# EAGLE design rapidshark-flywheel-controller-mk-1.5 (EAGLE 7.5.0)
AUTHOR: sean@yak.net
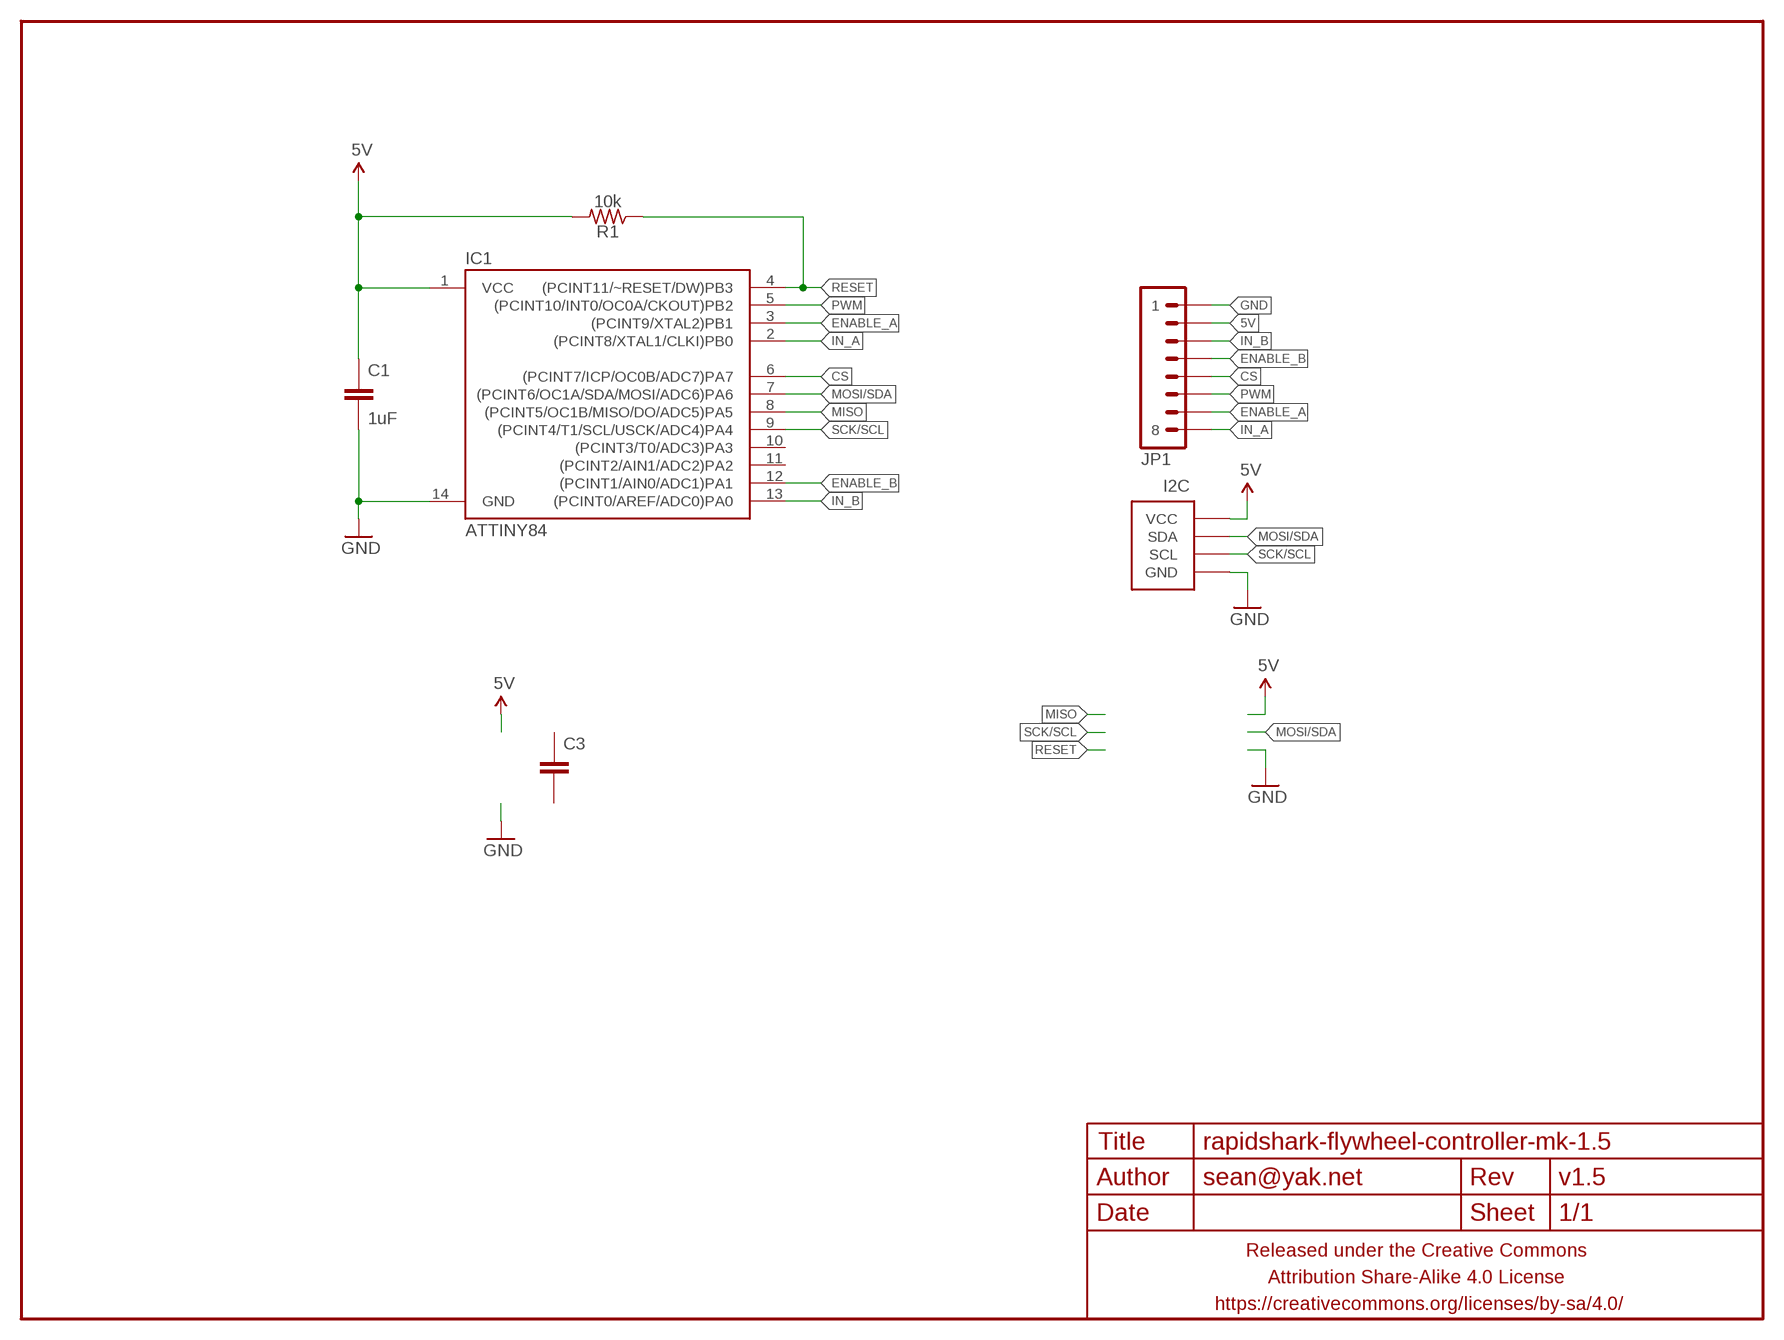
[diagram p0: schematic, sheet 1]

## Parts
C1  1uF  CAPACITOR-CERAMICC0603-TIGHTER  [C0603-TIGHTER]
C3  CAPACITOR-CERAMICC0603-TIGHTER  [C0603-TIGHTER]
FRAME1  FRAME-LETTERNO_PACKAGE  [DUMMY]
I2C  M04-I2CJST-4-PH-RA-CENTERED  [1X04-JST-PH-RA-PTH-I2C-CENTERED]
IC1  ATTINY84  [SO14]
JP1  M081X08  [1X08]
R1  10k  RESISTORPTH-AXIAL-5.08MM  [RESISTOR-AXIAL-PTH-5.08MM]

## Nets
5V: C1.1 I2C.2(VCC) IC1.1(VCC) JP1.2 R1.P$2
CS: IC1.6((PCINT7/ICP/OC0B/ADC7)PA7) JP1.5
ENABLE_A: IC1.3((PCINT9/XTAL2)PB1) JP1.7
ENABLE_B: IC1.12((PCINT1/AIN0/ADC1)PA1) JP1.4
GND: C1.2 I2C.1(GND) IC1.14(GND) JP1.1
IN_A: IC1.2((PCINT8/XTAL1/CLKI)PB0) JP1.8
IN_B: IC1.13((PCINT0/AREF/ADC0)PA0) JP1.3
MISO: IC1.8((PCINT5/OC1B/MISO/DO/ADC5)PA5)
MOSI/SDA: I2C.3(SDA) IC1.7((PCINT6/OC1A/SDA/MOSI/ADC6)PA6)
PWM: IC1.5((PCINT10/INT0/OC0A/CKOUT)PB2) JP1.6
RESET: IC1.4((PCINT11/~RESET/DW)PB3) R1.P$1
SCK/SCL: I2C.4(SCL) IC1.9((PCINT4/T1/SCL/USCK/ADC4)PA4)
Unconnected: C3.1 C3.2 IC1.10((PCINT3/T0/ADC3)PA3) IC1.11((PCINT2/AIN1/ADC2)PA2)

## Library data of the parts
C1 C3 = a_parts:CAPACITOR-CERAMIC: CAPACITOR, European symbol
FRAME1 = A_butts:FRAME-LETTER: Schematic Frame Standard 8.5x11 US Letter frame; DESIGNER: sean@yak.net; VERSION: v1.5
I2C = A_butts:M04-I2C
IC1 = A_butts:ATTINY84: Atmel 14-pin 2/4/8kB flash uC
JP1 = A_butts:M08: Header 8 Standard 8-pin 0.1" header. Use with straight break away headers (SKU : PRT-00116), right angle break away headers (PRT-00553), swiss pins (PRT-00743), machine pins (PRT-00117), and female headers (PRT-00115).
R1 = A_butts:RESISTOR: RESISTOR, American symbol

## Board
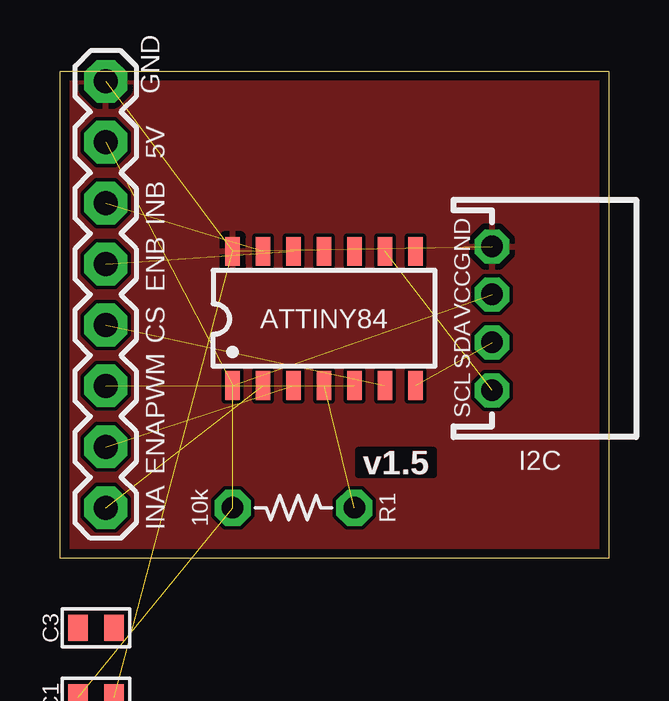
[diagram p1: board, top side]
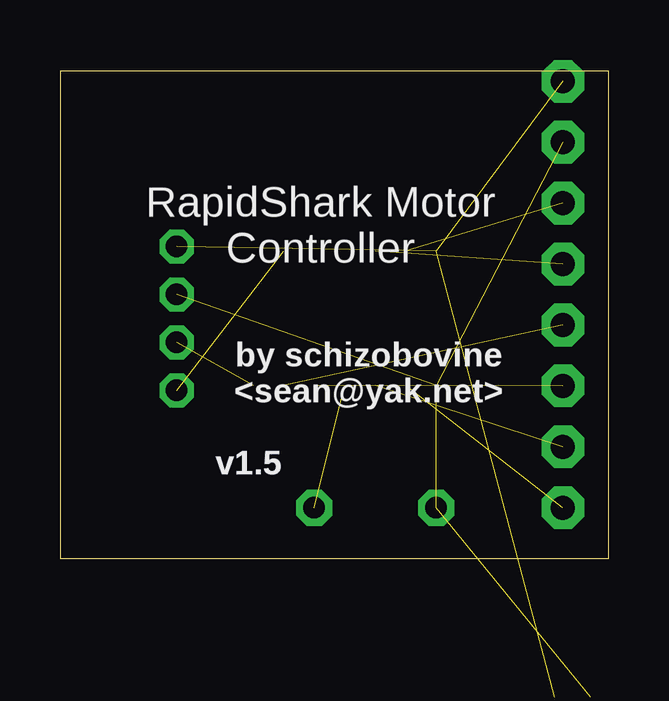
[diagram p2: board, bottom side, seen from below]

Size 22.86 x 20.32 mm. Coordinates in mm from the lower left corner, seen from the top.
Outline: 0,20.32 22.86,20.32 22.86,0 0,0 0,20.32
Copper layers (1*16): Top 0.0356mm / dielectric 1.5011mm / Bottom 0.0356mm
Design rules "LaenPCBOrder_2": minimum track width 6mil, minimum drill 13mil, track to track 6mil, track to pad 6mil, pad to pad 6mil, via to via 6mil, smd to smd 6mil, copper to edge 15mil, drill to drill 6mil, minimum pad ring 7mil, minimum via ring 7mil, stop-mask expansion 3mil, vias tented up to drill 20mil, thermal gap 10mil

### Footprints (pad centres in the part's own frame; a part is rotated, then mirrored left to right if it is on the bottom)
C0603-TIGHTER = smd 0.8 x 1.1: 1 -0.75,0; 2 0.75,0
1X04-JST-PH-RA-PTH-I2C-CENTERED = drill 0.9 pad 1.422 octagon: 1 -3,0; 2 -1,0; 3 1,0; 4 3,0
SO14 = smd 0.6 x 1.2: 1 -3.81,-2.8; 2 -2.54,-2.8; 3 -1.27,-2.8; 4 0,-2.8; 5 1.27,-2.8; 6 2.54,-2.8; 7 3.81,-2.8; 8 3.81,2.8; 9 2.54,2.8; 10 1.27,2.8; 11 0,2.8; 12 -1.27,2.8; 13 -2.54,2.8; 14 -3.81,2.8
1X08 = drill 1 pad 1.778 octagon: 1 0,0; 2 2.54,0; 3 5.08,0; 4 7.62,0; 5 10.16,0; 6 12.7,0; 7 15.24,0; 8 17.78,0
RESISTOR-AXIAL-PTH-5.08MM = drill 0.9 pad 1.5 octagon: P$1 -2.54,0; P$2 2.54,0

### Placement (x,y rotation side)
C1  1.5,-5.8 0 top  (outside the outline)
C3  1.5,-2.9 0 top
FRAME1  0,0 0 bottom
I2C  18,10 270 top
IC1  11,10 0 top
JP1  1.91,19.89 270 top
R1  9.73,2.11 180 top

### Tracks (layer width: path | path; a pad name or v marks a point on that pad's centre or on a via)
5V  (4 unrouted)
CS  (1 unrouted)
ENABLE_A  (1 unrouted)
ENABLE_B  (1 unrouted)
GND  (3 unrouted)
  pour Top (rank 6): 22.86,0 0,0 0,20.32 22.86,20.32
IN_A  (1 unrouted)
IN_B  (1 unrouted)
MOSI/SDA  (1 unrouted)
PWM  (1 unrouted)
RESET  (1 unrouted)
SCK/SCL  (1 unrouted)

### Text on the board
tPlace: GND | 5V | INB | ENB | CS | PWM | ENA | INA
bPlace: RapidShark Motor / Controller | by schizobovine / <sean@yak.net>